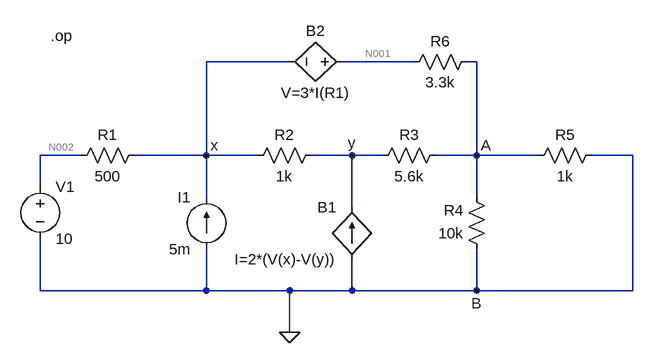
[diagram p0: schematic Circuit6.asc]
Circuit6.asc, the LTspice schematic file:
Version 4
SHEET 1 936 680
WIRE 400 -32 272 -32
WIRE 592 -32 480 -32
WIRE 688 -32 672 -32
WIRE 80 112 16 112
WIRE 272 112 272 -32
WIRE 272 112 160 112
WIRE 352 112 272 112
WIRE 496 112 432 112
WIRE 544 112 496 112
WIRE 688 112 688 -32
WIRE 688 112 624 112
WIRE 784 112 688 112
WIRE 928 112 864 112
WIRE 16 160 16 112
WIRE 272 176 272 112
WIRE 688 176 688 112
WIRE 496 192 496 112
WIRE 16 320 16 240
WIRE 272 320 272 256
WIRE 272 320 16 320
WIRE 400 320 272 320
WIRE 496 320 496 272
WIRE 496 320 400 320
WIRE 688 320 688 256
WIRE 688 320 496 320
WIRE 928 320 928 112
WIRE 928 320 688 320
WIRE 400 384 400 320
FLAG 272 112 x
FLAG 496 112 y
FLAG 688 112 A
FLAG 688 320 B
FLAG 400 384 0
SYMBOL voltage 16 144 R0
SYMATTR InstName V1
SYMATTR Value 10
SYMBOL res 176 96 R90
WINDOW 0 0 56 VBottom 2
WINDOW 3 32 56 VTop 2
SYMATTR InstName R1
SYMATTR Value 500
SYMBOL res 336 128 R270
WINDOW 0 32 56 VTop 2
WINDOW 3 0 56 VBottom 2
SYMATTR InstName R2
SYMATTR Value 1k
SYMBOL res 640 96 R90
WINDOW 0 0 56 VBottom 2
WINDOW 3 32 56 VTop 2
SYMATTR InstName R3
SYMATTR Value 5.6k
SYMBOL res 704 272 R180
WINDOW 0 36 76 Left 2
WINDOW 3 36 40 Left 2
SYMATTR InstName R4
SYMATTR Value 10k
SYMBOL res 768 128 R270
WINDOW 0 32 56 VTop 2
WINDOW 3 0 56 VBottom 2
SYMATTR InstName R5
SYMATTR Value 1k
SYMBOL res 576 -16 R270
WINDOW 0 32 56 VTop 2
WINDOW 3 0 56 VBottom 2
SYMATTR InstName R6
SYMATTR Value 3.3k
SYMBOL bv 496 -32 R90
WINDOW 0 -32 56 VBottom 2
WINDOW 3 32 56 VTop 2
SYMATTR InstName B2
SYMATTR Value V=3*I(R1)
SYMBOL bi 496 272 R180
WINDOW 0 24 80 Left 2
WINDOW 3 24 0 Left 2
SYMATTR InstName B1
SYMATTR Value I=2*(V(x)-V(y))
SYMBOL current 272 256 R180
WINDOW 0 24 80 Left 2
WINDOW 3 24 0 Left 2
SYMATTR InstName I1
SYMATTR Value 5m
TEXT 32 -72 Left 2 !.op

The netlist it stands for:
* Circuit6.asc
V1 N002 0 10
R1 x N002 500
R2 x y 1k
R3 A y 5.6k
R4 0 A 10k
R5 A 0 1k
R6 N001 A 3.3k
B2 N001 x V=3*I(R1)
B1 0 y I=2*(V(x)-V(y))
I1 0 x 5m
.op
.backanno
.end

* Results of the author's LTspice run, read from the files saved beside the schematic
* Operating Point:
*   V(n002) = 10 V
*   V(x) = 11.31 V
*   V(y) = 11.31 V
*   V(a) = 3.444 V
*   V(n001) = 11.31 V
*   I(B1) = 1.403 mA
*   I(B2) = -2.385 mA
*   I(I1) = 5 mA
*   I(R6) = 2.385 mA
*   I(R5) = 3.444 mA
*   I(R4) = -344.4 µA
*   I(R3) = -1.404 mA
*   I(R2) = 701.6 nA
*   I(R1) = 2.614 mA
*   I(V1) = 2.614 mA